# Altium schematic sheet Sheet1.SchDoc
size A3; SheetNumber: 1; SheetTotal: 1
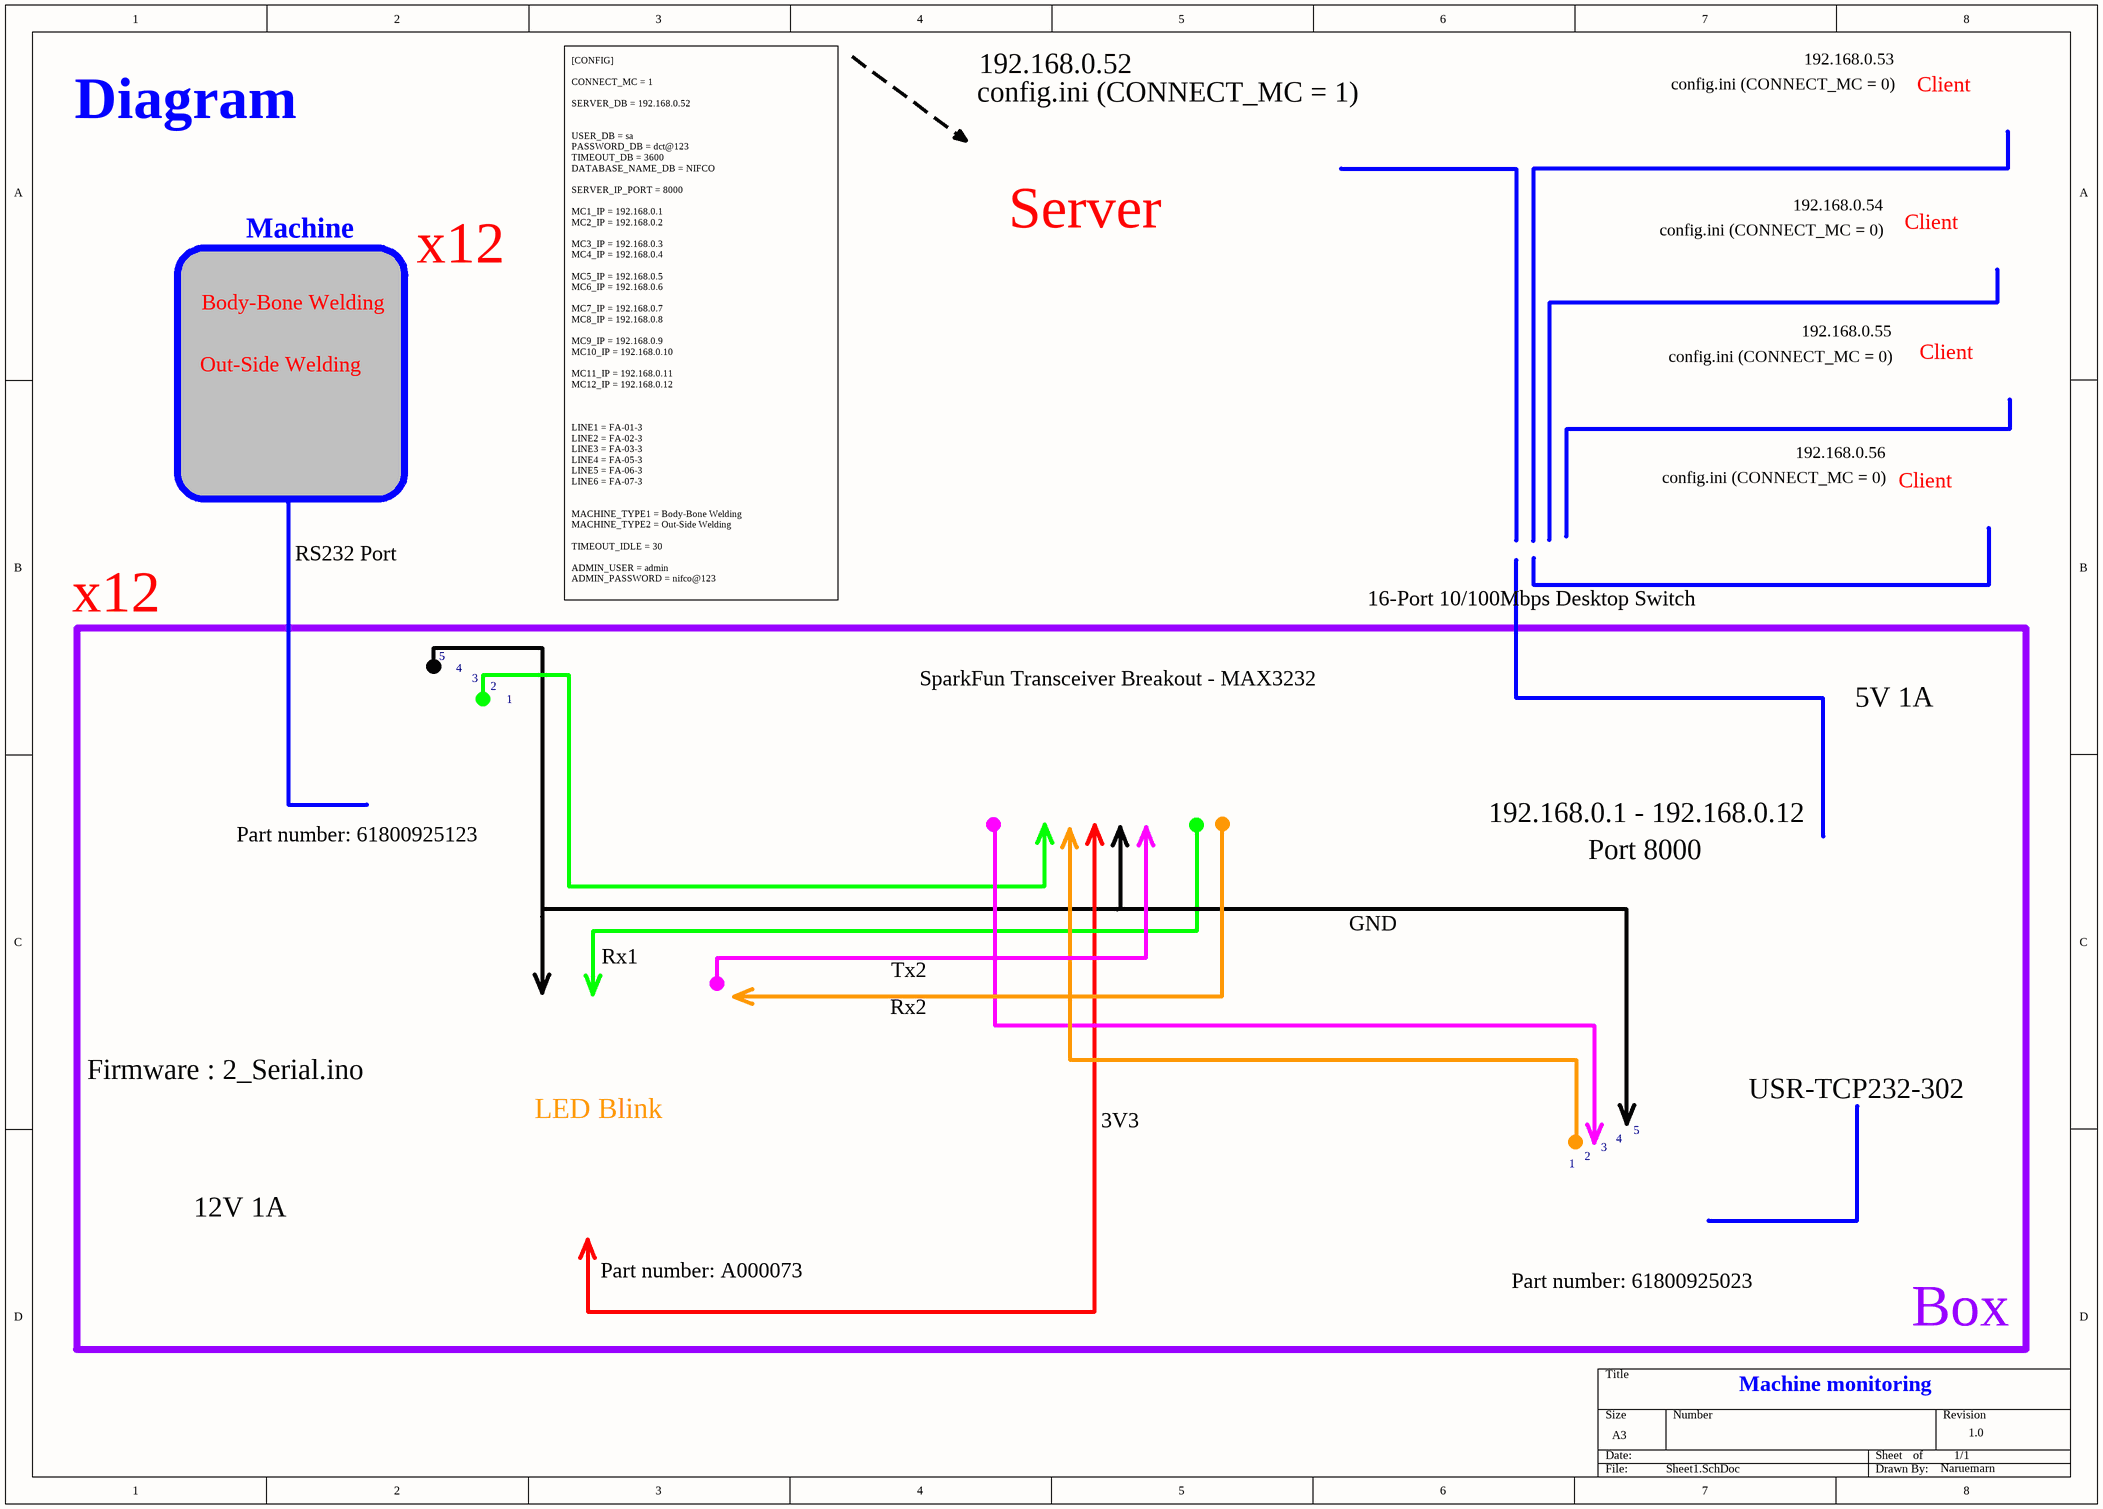
[diagram p0: Sheet1.SchDoc]

## Notes on the sheet
- config.ini (CONNECT_MC = 1)
- 192.168.0.52
- config.ini (CONNECT_MC = 0)
- 192.168.0.53
- Client
- Diagram
- Machine
- Server
- 192.168.0.54
- Body-Bone Welding
- x12
- Out-Side Welding
- 192.168.0.55
- 192.168.0.56
- RS232 Port
- [CONFIG]
  CONNECT_MC = 1
  SERVER_DB = 192.168.0.52
  USER_DB = sa
  PASSWORD_DB = dct@123
  TIMEOUT_DB = 3600
  DATABASE_NAME_DB = NIFCO
  SERVER_IP_PORT = 8000
  MC1_IP = 192.168.0.1
  MC2_IP = 192.168.0.2
  MC3_IP = 192.168.0.3
  MC4_IP = 192.168.0.4
  MC5_IP = 192.168.0.5
  MC6_IP = 192.168.0.6
  MC7_IP = 192.168.0.7
  MC8_IP = 192.168.0.8
  MC9_IP = 192.168.0.9
  MC10_IP = 192.168.0.10
  MC11_IP = 192.168.0.11
  MC12_IP = 192.168.0.12
  LINE1 = FA-01-3
  LINE2 = FA-02-3
  LINE3 = FA-03-3
  LINE4 = FA-05-3
  LINE5 = FA-06-3
  LINE6 = FA-07-3
  MACHINE_TYPE1 = Body-Bone Welding
  MACHINE_TYPE2 = Out-Side Welding
  TIMEOUT_IDLE = 30
  ADMIN_USER = admin
  ADMIN_PASSWORD = nifco@123
- 16-Port 10/100Mbps Desktop Switch
- 5
- 4
- 3
- 2
- 1
- SparkFun Transceiver Breakout - MAX3232
- 5V 1A
- Part number: 61800925123
- 192.168.0.1 - 192.168.0.12
- Port 8000
- Rx1
- Tx2
- GND
- Rx2
- Firmware : 2_Serial.ino
- LED Blink
- USR-TCP232-302
- 3V3
- 12V 1A
- Part number: A000073
- Part number: 61800925023
- Machine monitoring
- Box
- 1/1
- 1.0
- Naruemarn